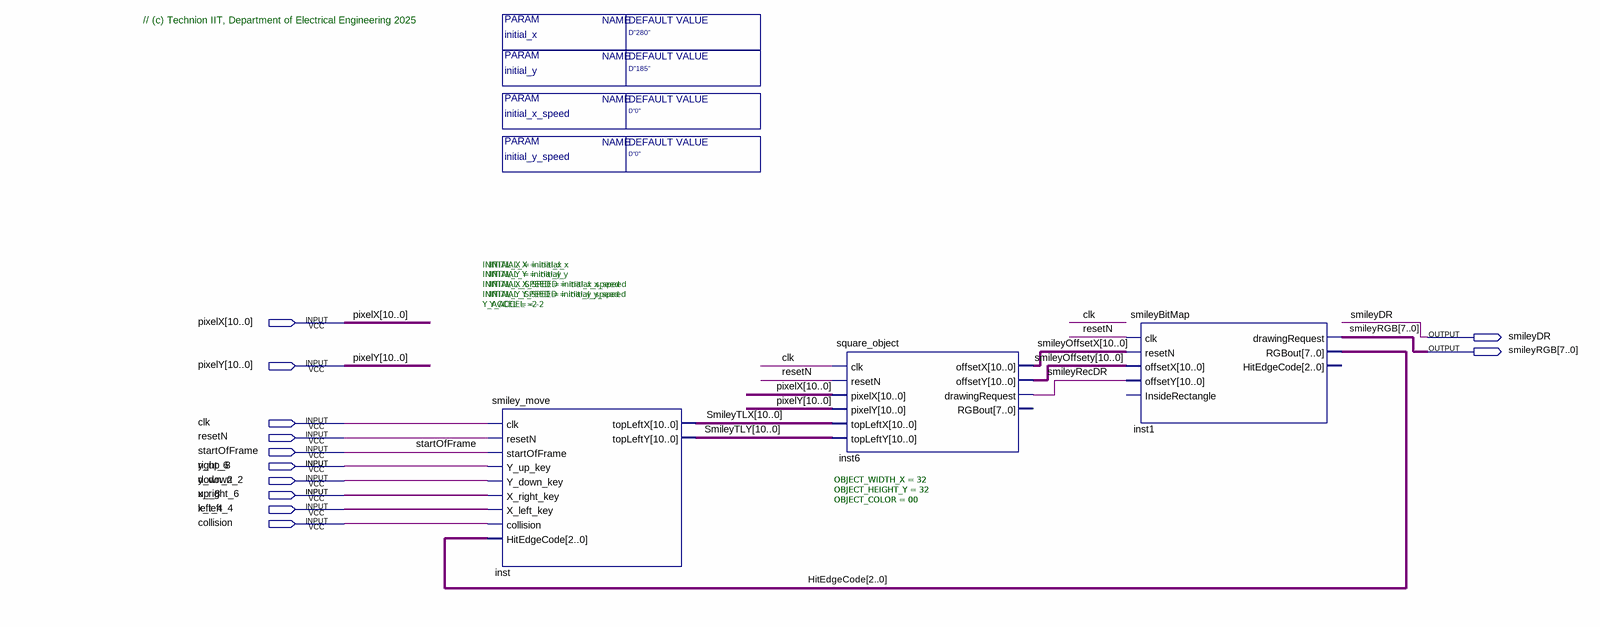
[diagram p0: schematic sheet]
// Quartus schematic Smiley_Block_T.bdf as structural Verilog: 3 symbols, 12 pins
module Smiley_Block_T #(parameter initial_x = "D\"280\"", parameter initial_y = "D\"185\"", parameter initial_y_speed = "D\"0\"", parameter initial_x_speed = "D\"0\"") (
  input  [10:0] pixelX,
  input  [10:0] pixelY,
  input  clk,
  input  resetN,
  input  startOfFrame,
  input  y_up_8,
  input  y_down_2,
  input  x_right_6,
  input  x_left_4,
  input  collision,
  output smileyDR,
  output [7:0] smileyRGB
);

  wire smileyRecDR;
  wire [2:0] HitEdgeCode;
  wire [10:0] smileyOffsetX, smileyOffsety, SmileyTLX, SmileyTLY;

  smiley_move #(.INITIAL_X(initial_x), .INITIAL_Y(initial_y), .INITIAL_X_SPEED(initial_x_speed), .INITIAL_Y_SPEED(initial_y_speed), .Y_ACCEL(-2)) inst (
    .clk(clk), .resetN(resetN), .startOfFrame(startOfFrame), .Y_up_key(y_up_8), .Y_down_key(y_down_2),
    .X_right_key(x_right_6), .X_left_key(x_left_4), .collision(collision), .HitEdgeCode(HitEdgeCode),
    .topLeftX(SmileyTLX), .topLeftY(SmileyTLY));
  square_object #(.OBJECT_WIDTH_X(32), .OBJECT_HEIGHT_Y(32), .OBJECT_COLOR(00)) inst6 (
    .clk(clk), .resetN(resetN), .pixelX(pixelX), .pixelY(pixelY), .topLeftX(SmileyTLX), .topLeftY(SmileyTLY),
    .offsetX(smileyOffsetX), .offsetY(smileyOffsety), .drawingRequest(smileyRecDR));  // open: RGBout
  smileyBitMap inst1 (
    .clk(resetN), .resetN(smileyOffsetX), .offsetX(smileyOffsety), .offsetY({11{smileyRecDR}}),
    .drawingRequest(smileyRGB), .RGBout(HitEdgeCode));  // open: InsideRectangle, HitEdgeCode

  // Notes on the sheet:
  //   // (c) Technion IIT, Department of Electrical Engineering 2025
endmodule
